# EAGLE schematic CapstoneREV_10-29-25_2 (EAGLE 9.5.0)
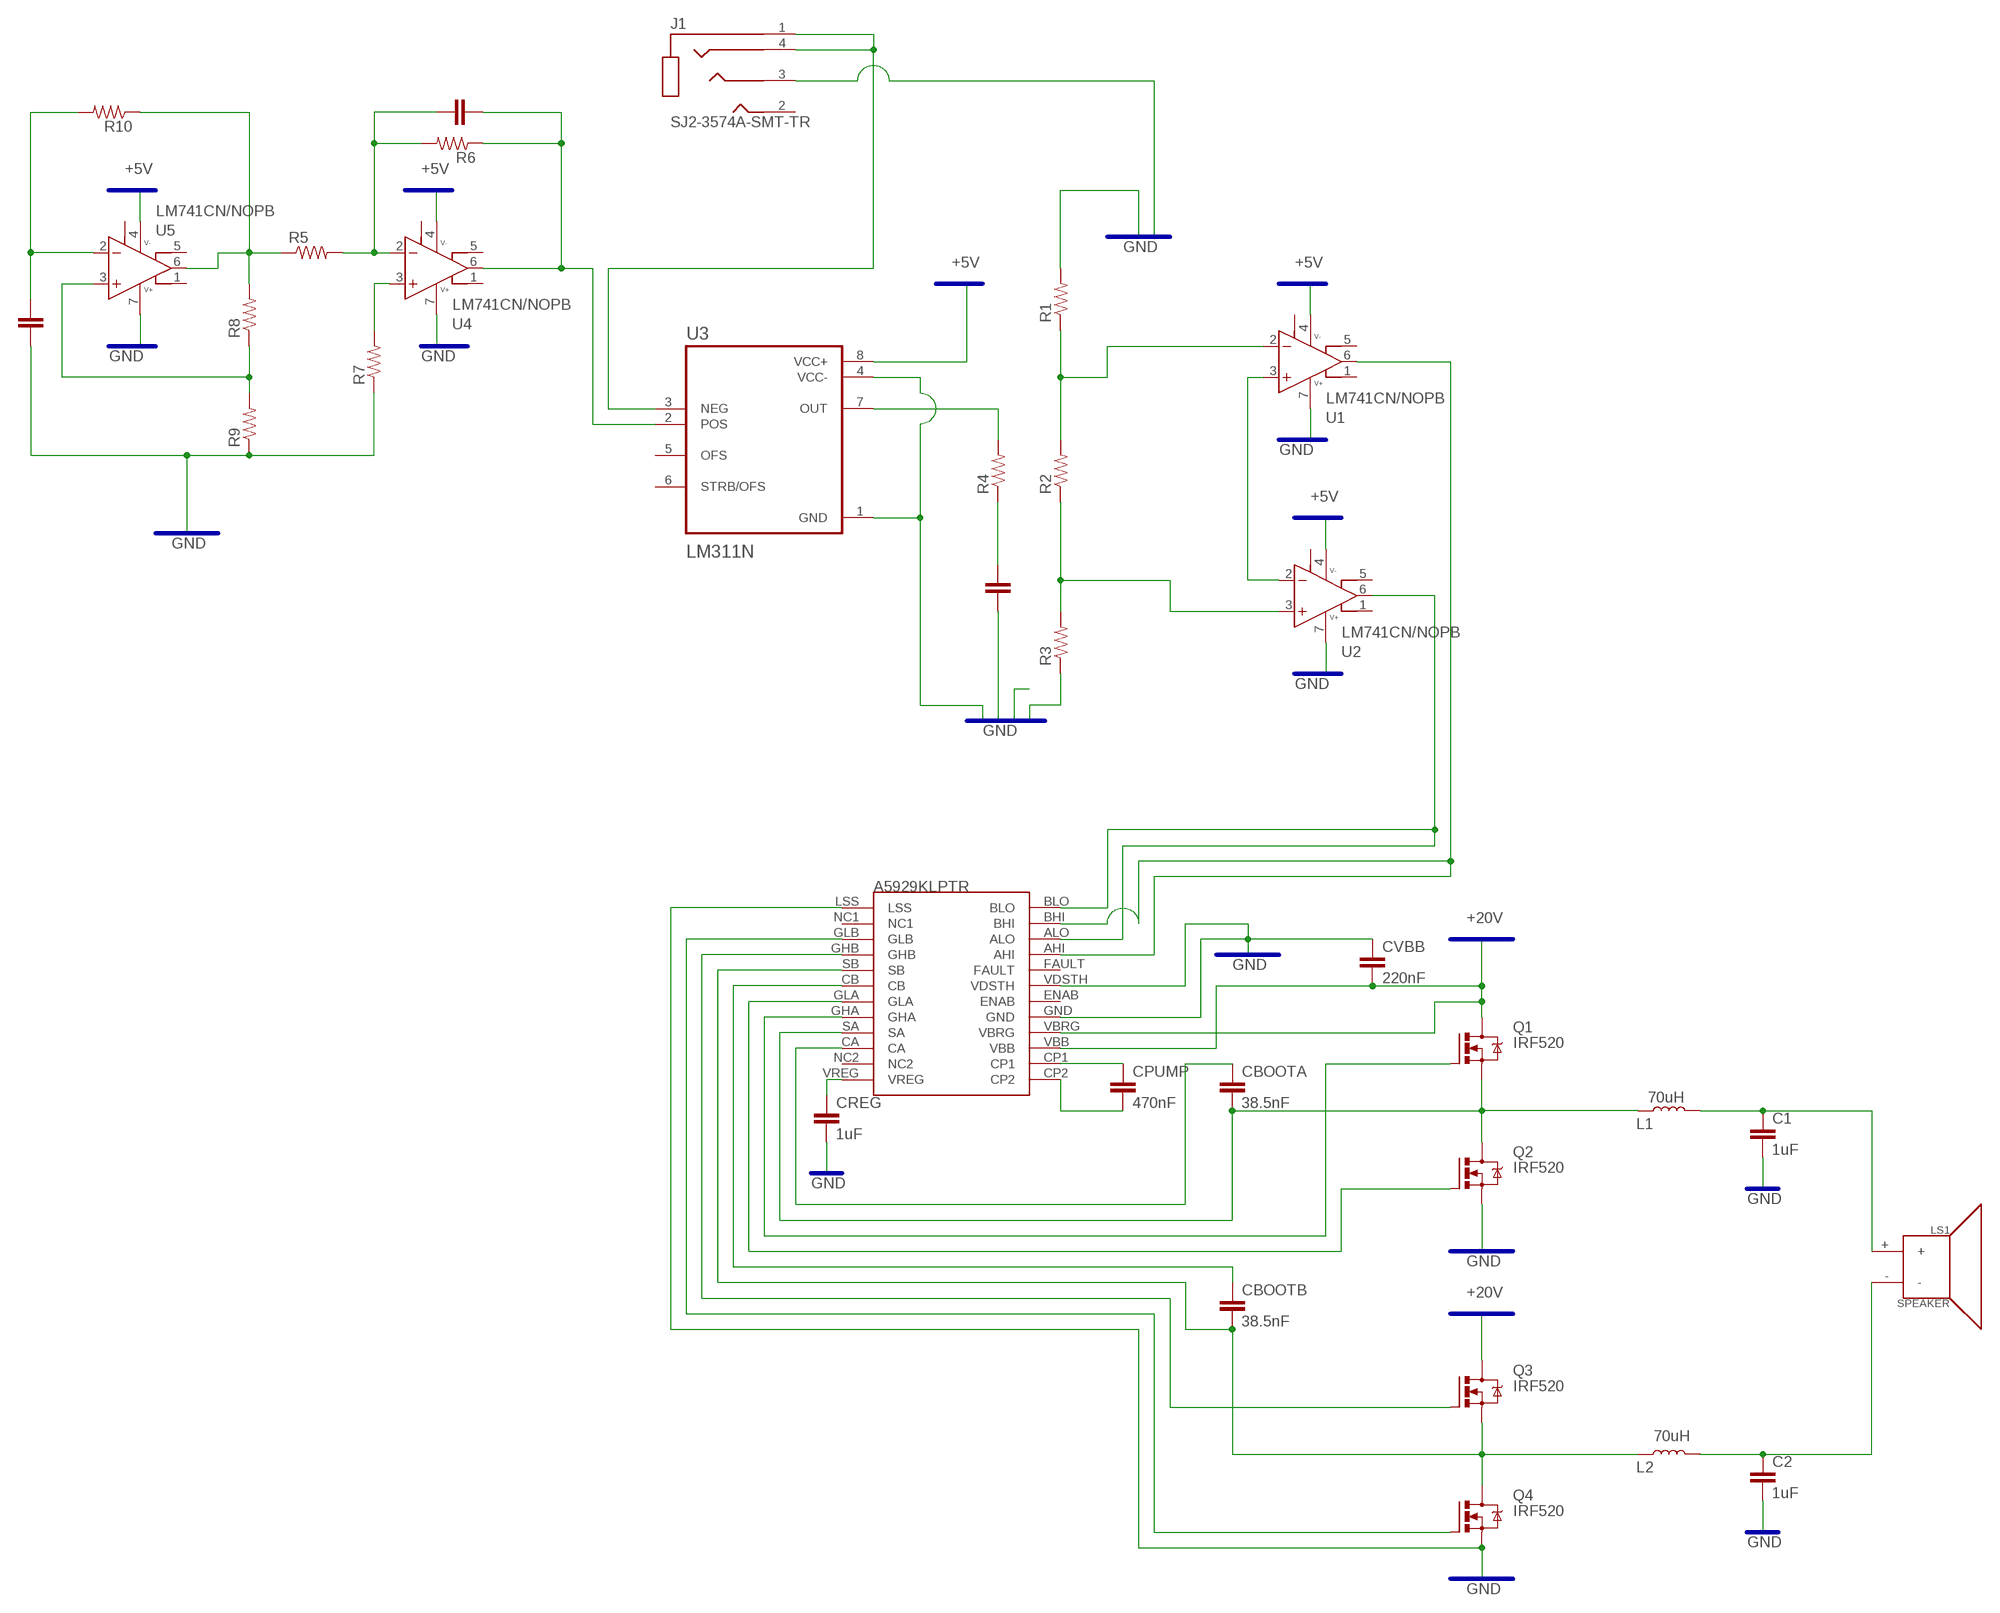
[diagram p0: schematic, sheet 1]

## Parts
C1  1uF  4.7NF-50V-10%(0603)  [0603]
C2  1uF  4.7NF-50V-10%(0603)  [0603]
CBOOTA  38.5nF  4.7NF-50V-10%(0603)  [0603]
CBOOTB  38.5nF  4.7NF-50V-10%(0603)  [0603]
CPUMP  470nF  4.7NF-50V-10%(0603)  [0603]
CREG  1uF  4.7NF-50V-10%(0603)  [0603]
CVBB  220nF  4.7NF-50V-10%(0603)  [0603]
J1  SJ2-3574A-SMT-TR  [SAMESKY_SJ2-3574A-SMT-TR]
L1  70uH  1.5UH-2X2-1.4A  [INDUCTOR_2X2]
L2  70uH  1.5UH-2X2-1.4A  [INDUCTOR_2X2]
LS1  SPEAKER  [PCB_MOUNT_SPEAKER]
Q1  IRF520  [TO220BV]
Q2  IRF520  [TO220BV]
Q3  IRF520  [TO220BV]
Q4  IRF520  [TO220BV]
R1  R-US_0207/12  [0207/12]
R2  R-US_0207/12  [0207/12]
R3  R-US_0207/12  [0207/12]
R4  R-US_0207/12  [0207/12]
R5  R-US_0207/12  [0207/12]
R6  R-US_0207/12  [0207/12]
R7  R-US_0207/12  [0207/12]
R8  R-US_0207/12  [0207/12]
R9  R-US_0207/12  [0207/12]
R10  R-US_0207/12  [0207/12]
U1  LM741CN/NOPB  [DIP794W45P254L959H508Q8]
U2  LM741CN/NOPB  [DIP794W45P254L959H508Q8]
U3  LM311N  [DIP794W45P254L959H508Q8]
U4  LM741CN/NOPB  [DIP794W45P254L959H508Q8]
U5  LM741CN/NOPB  [DIP794W45P254L959H508Q8]
U$1  A5929KLPTR  [A5929]

## Nets
+5V: U1.4(V-) U2.4(V-) U4.4(V-) U5.4(V-)
+20V: CVBB.2 Q1.D Q3.D U$1.VBB U$1.VBRG
GND: C1.2 C2.2 CREG.2 CVBB.1 J1.3(RING1) Q2.S Q4.S R1.2 R3.1 R7.1 R9.1 U1.7(V+) U2.7(V+) U3.1(GND) U3.4(VCC-) U4.7(V+) U5.7(V+) U$1.GND U$1.LSS U$1.VDSTH
N$1: R4.1
N$2: R1.1 R2.2 U1.2(-IN)
N$3: R2.1 R3.2 U2.3(+IN)
N$4: U2.6(OUT) U$1.ALO U$1.BLO
N$5: Q2.G U$1.GLA
N$6: U1.3(+IN) U2.2(-IN)
N$7: C2.1 L2.P$2 LS1.-
N$8: C1.1 L1.P$2 LS1.+
N$9: CREG.1 U$1.VREG
N$10: U1.6(OUT) U$1.AHI U$1.BHI
N$11: CBOOTA.1 U$1.CA
N$12: CBOOTA.2 L1.P$1 Q1.S Q2.D U$1.SA
N$13: CPUMP.2 U$1.CP2
N$14: CPUMP.1 U$1.CP1
N$15: Q1.G U$1.GHA
N$16: R10.2 U5.2(-IN)
N$17: R5.2 R6.2 U4.2(-IN)
N$18: CBOOTB.1 U$1.CB
N$19: R4.2 U3.7(OUT)
N$20: CBOOTB.2 L2.P$1 Q3.S Q4.D U$1.SB
N$21: Q3.G U$1.GHB
N$22: Q4.G U$1.GLB
N$23: R8.1 R9.2 U5.3(+IN)
N$25: U3.8(VCC+)
N$26: R5.1 R8.2 R10.1 U5.6(OUT)
N$28: R7.2 U4.3(+IN)
N$30: R6.1 U3.2(POS) U4.6(OUT)
N$31: J1.1(SLEEVE) J1.4(RING2) U3.3(NEG)
Unconnected: J1.2(TIP) U1.1(OFFSE_NULL1) U1.5(OFFSET_NULL5) U1.8(NC) U2.1(OFFSE_NULL1) U2.5(OFFSET_NULL5) U2.8(NC) U3.5(OFS) U3.6(STRB/OFS) U4.1(OFFSE_NULL1) U4.5(OFFSET_NULL5) U4.8(NC) U5.1(OFFSE_NULL1) U5.5(OFFSET_NULL5) U5.8(NC) U$1.ENAB U$1.FAULT U$1.NC1 U$1.NC2

## Buses
+10V,+20V
-10V,GND,N$2
GND
+5V

## Library data of the parts
C1 C2 CBOOTA CBOOTB CPUMP CREG CVBB = SparkFun-Retired:4.7NF-50V-10%(0603): CAP-11378; PROD_ID: CAP-11378; VALUE: 4.7nF
J1 = SJ2-3574A-SMT-TR:SJ2-3574A-SMT-TR: Check availability <https://pricing.snapeda.com/parts/SJ2-3574A-SMT-TR/Same%20Sky/view-part?ref=eda>; AVAILABILITY: In Stock; CHECK_PRICES: https://www.snapeda.com/parts/SJ2-3574A-SMT-TR/Same+Sky/view-part/?ref=eda; DESCRIPTION: 4 conductors, 3.5mm, SMT Audio Jack; MF: Same Sky; MP: SJ2-3574A-SMT-TR; PACKAGE: None; PRICE: None; SNAPEDA_LINK: https://www.snapeda.com/parts/SJ2-3574A-SMT-TR/Same+Sky/view-part/?ref=snap
L1 L2 = SparkFun-Coils:1.5UH: FIXED IND 1.5UH 1.4A 120 MOHM; PROD_ID: NDUC-15405; VALUE: 1.5uH
LS1 = SparkFun-Electromechanical:SPEAKER: Speaker Generic 2-terminal loudspeakers SparkFun Products Speaker - PCB Mount <https://www.sparkfun.com/products/11089> (COM-11089); PROD_ID: COMP-11789; SF_SKU: COM-11089
Q1-Q4 = transistor-power:IRF520: HEXFET Power MOSFET
R1-R10 = resistor:R-US_: RESISTOR, American symbol
U1 U2 U4 U5 = LM741CN_NOPB:LM741CN/NOPB: Check availability <https://pricing.snapeda.com/parts/LM741CN/NOPB/Texas%20Instruments/view-part?ref=eda>; AVAILABILITY: In Stock; CHECK_PRICES: https://www.snapeda.com/parts/LM741CN/NOPB/Texas+Instruments/view-part/?ref=eda; DESCRIPTION: Single, 44-V, 1-MHz operational amplifier; MF: Texas Instruments; MP: LM741CN/NOPB; PACKAGE: PDIP-8 Texas; PRICE: None; SNAPEDA_LINK: https://www.snapeda.com/parts/LM741CN/NOPB/Texas+Instruments/view-part/?ref=snap
U3 = LM311N:LM311N: Check availability <https://pricing.snapeda.com/parts/LM311N/NOPB/Texas%20Instruments/view-part?ref=eda>; AVAILABILITY: In Stock; CHECK_PRICES: https://www.snapeda.com/parts/LM311N/NOPB/Texas+Instruments/view-part/?ref=eda; DESCRIPTION: Precision, high voltage, floating output comparator; MF: Texas Instruments; MP: LM311N/NOPB; PACKAGE: PDIP-8 Texas; PRICE: None; SNAPEDA_LINK: https://www.snapeda.com/parts/LM311N/NOPB/Texas+Instruments/view-part/?ref=snap
U$1 = Allegro A5929:A5929KLPTR